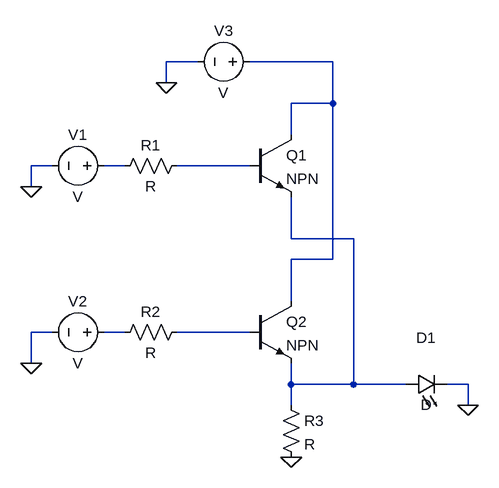
[diagram p0: schematic OR_Gate.asc]
OR_Gate.asc, the LTspice schematic file:
Version 4
SHEET 1 880 680
WIRE 48 -48 0 -48
WIRE 256 -48 128 -48
WIRE 0 -16 0 -48
WIRE 256 16 256 -48
WIRE 256 16 192 16
WIRE 192 64 192 16
WIRE -176 112 -208 112
WIRE -64 112 -96 112
WIRE 128 112 16 112
WIRE -208 144 -208 112
WIRE 192 224 192 160
WIRE 288 224 192 224
WIRE 256 256 256 16
WIRE 256 256 192 256
WIRE 192 320 192 256
WIRE -176 368 -208 368
WIRE -64 368 -96 368
WIRE 128 368 16 368
WIRE -208 416 -208 368
WIRE 192 448 192 416
WIRE 288 448 288 224
WIRE 288 448 192 448
WIRE 368 448 288 448
WIRE 464 448 432 448
WIRE 192 480 192 448
WIRE 464 480 464 448
FLAG -208 144 0
FLAG -208 416 0
FLAG 192 560 0
FLAG 464 480 0
FLAG 0 -16 0
SYMBOL npn 128 64 R0
SYMATTR InstName Q1
SYMBOL npn 128 320 R0
SYMATTR InstName Q2
SYMBOL res 32 96 R90
WINDOW 0 0 56 VBottom 2
WINDOW 3 32 56 VTop 2
SYMATTR InstName R1
SYMBOL res 32 352 R90
WINDOW 0 0 56 VBottom 2
WINDOW 3 32 56 VTop 2
SYMATTR InstName R2
SYMBOL voltage -80 112 R90
WINDOW 0 -32 56 VBottom 2
WINDOW 3 32 56 VTop 2
SYMATTR InstName V1
SYMBOL voltage -80 368 R90
WINDOW 0 -32 56 VBottom 2
WINDOW 3 32 56 VTop 2
SYMATTR InstName V2
SYMBOL res 176 464 R0
SYMATTR InstName R3
SYMBOL LED 368 464 R270
WINDOW 0 72 32 VTop 2
WINDOW 3 0 32 VBottom 2
SYMATTR InstName D1
SYMBOL voltage 144 -48 R90
WINDOW 0 -32 56 VBottom 2
WINDOW 3 32 56 VTop 2
SYMATTR InstName V3

The netlist it stands for:
* OR_Gate.asc
Q1 N001 N003 N004 0 NPN
Q2 N001 N006 N004 0 NPN
R1 N003 N002 R
R2 N006 N005 R
V1 N002 0 V
V2 N005 0 V
R3 N004 0 R
D1 N004 0 D
V3 N001 0 V
.model D D
.lib standard.dio
.model NPN NPN
.model PNP PNP
.lib standard.bjt
.backanno
.end